# Altium schematic sheet 11-DisplayPort.SchDoc
size B; SheetNumber: 10; SheetTotal: 19
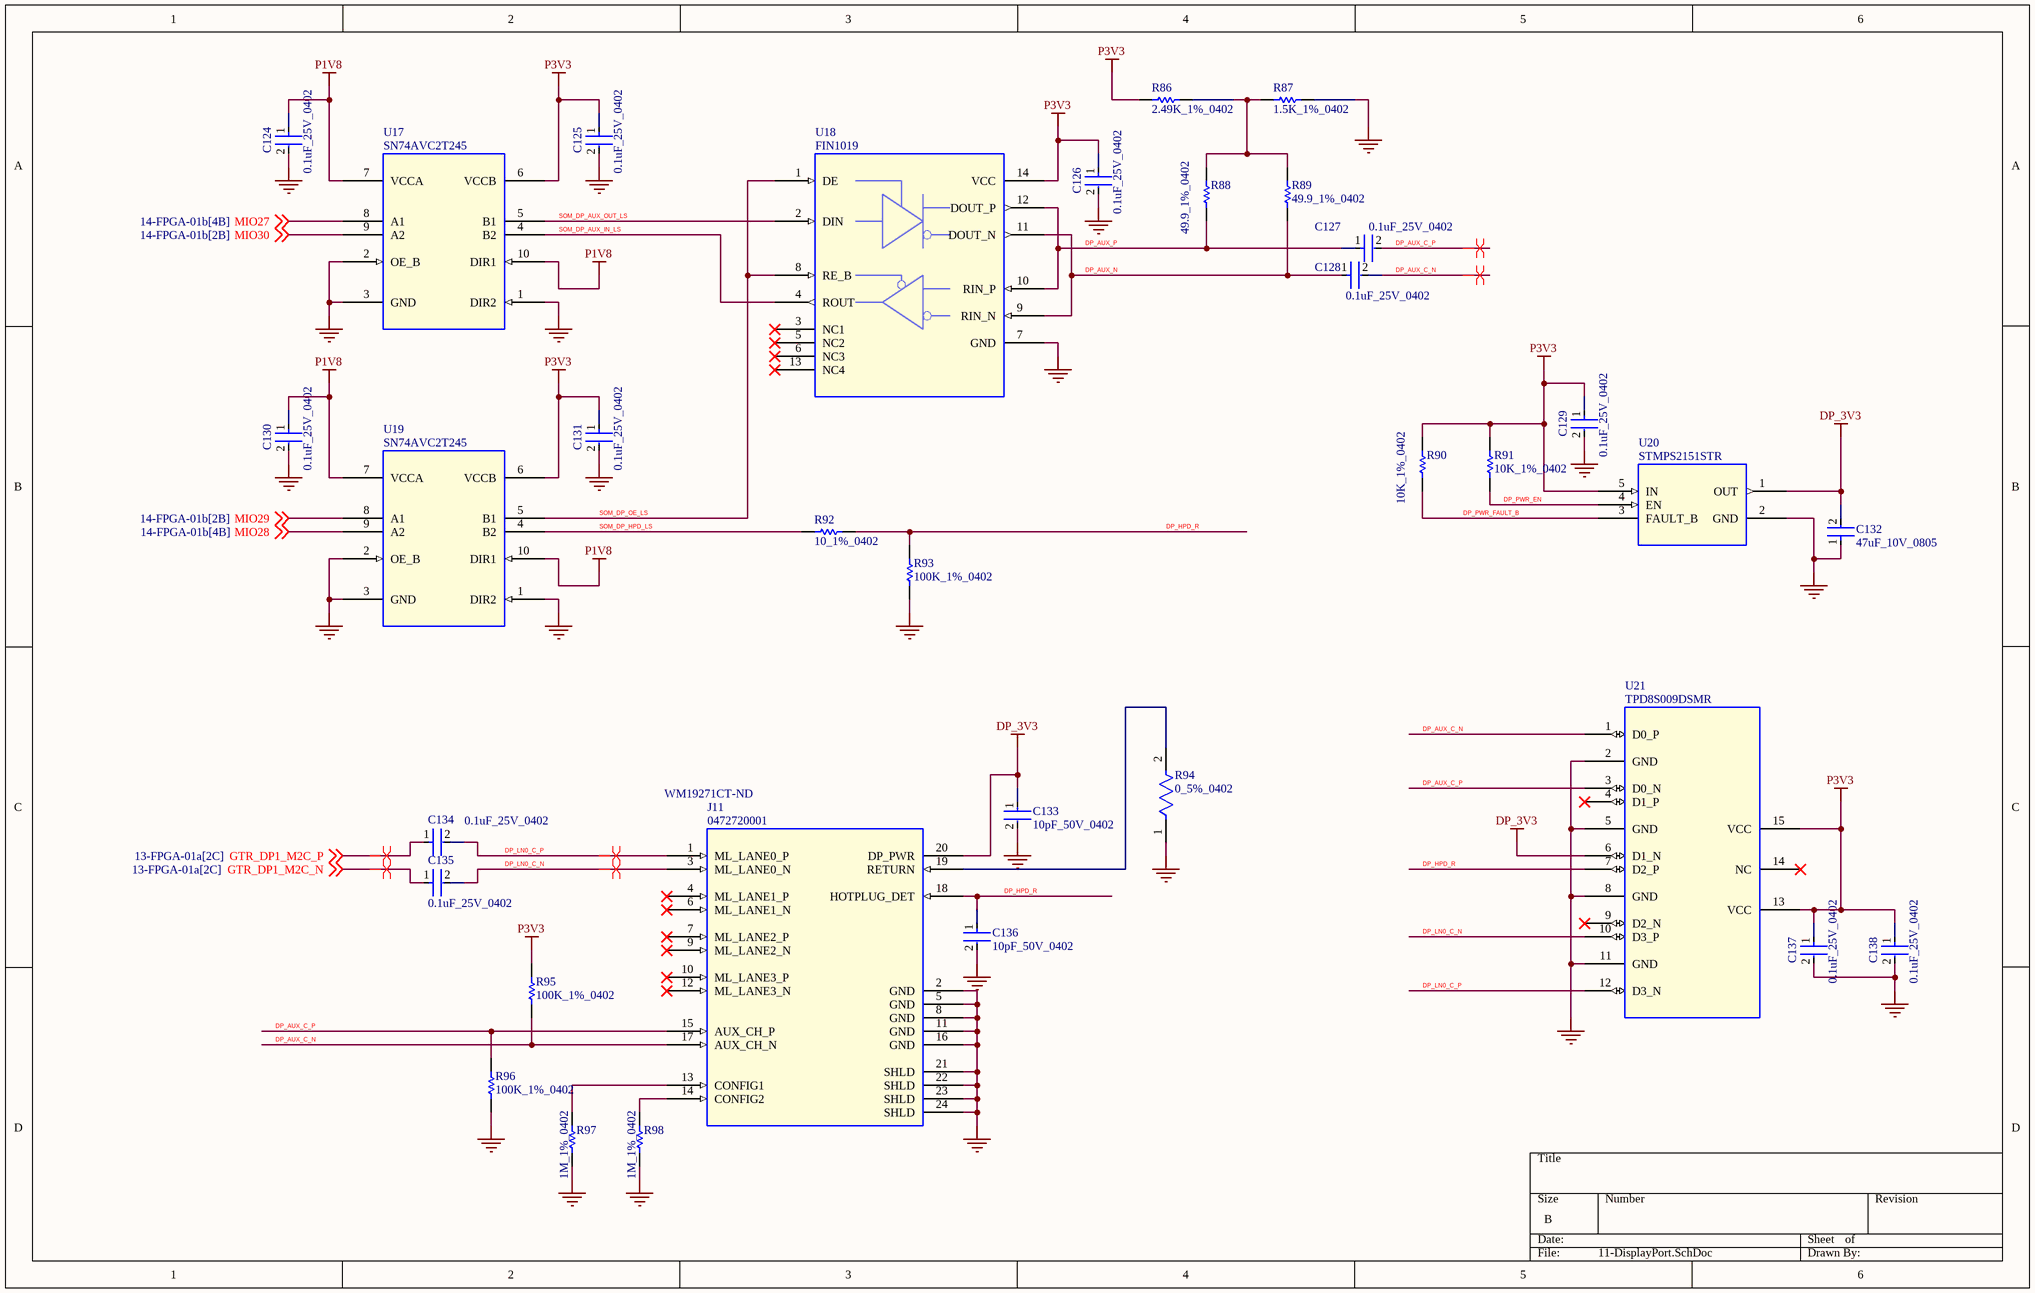
[diagram p0: 11-DisplayPort.SchDoc]

## Parts
C124  0.1uF_25V_0402  [FP-0402-L_1_0_1-W_0_5_0_1-IPC_C]
C125  0.1uF_25V_0402  [FP-0402-L_1_0_1-W_0_5_0_1-IPC_C]
C126  0.1uF_25V_0402  [FP-0402-L_1_0_1-W_0_5_0_1-IPC_C]
C127  0.1uF_25V_0402  [FP-0402-L_1_0_1-W_0_5_0_1-IPC_C]
C128  0.1uF_25V_0402  [FP-0402-L_1_0_1-W_0_5_0_1-IPC_C]
C129  0.1uF_25V_0402  [FP-0402-L_1_0_1-W_0_5_0_1-IPC_C]
C130  0.1uF_25V_0402  [FP-0402-L_1_0_1-W_0_5_0_1-IPC_C]
C131  0.1uF_25V_0402  [FP-0402-L_1_0_1-W_0_5_0_1-IPC_C]
C132  47uF_10V_0805  [FP-GRM21B-0_2-e0_2_0_7-IPC_A]
C133  10pF_50V_0402  [FP-C1005-050-0_05-IPC_C]
C134  0.1uF_25V_0402  [FP-0402-L_1_0_1-W_0_5_0_1-IPC_C]
C135  0.1uF_25V_0402  [FP-0402-L_1_0_1-W_0_5_0_1-IPC_C]
C136  10pF_50V_0402  [FP-C1005-050-0_05-IPC_C]
C137  0.1uF_25V_0402  [FP-0402-L_1_0_1-W_0_5_0_1-IPC_C]
C138  0.1uF_25V_0402  [FP-0402-L_1_0_1-W_0_5_0_1-IPC_C]
J11  0472720001  Supplier Part Number 1: WM19271CT-ND  [CON_MOLEX_47272]
R86  2.49K_1%_0402  [RESC1005X40X25ML05T05]
R87  1.5K_1%_0402  [RESC1005X40X25NL05T05]
R88  49.9_1%_0402  [RESC1005X40X25NL10T10]
R89  49.9_1%_0402  [RESC1005X40X25NL10T10]
R90  10K_1%_0402  [RESC1005X40X25ML05T05]
R91  10K_1%_0402  [RESC1005X40X25ML05T05]
R92  10_1%_0402  [RESC1005X40X25LL10T10]
R93  100K_1%_0402  [RESC1005X40X25ML05T05]
R94  0_5%_0402  [FP-AC0402-0_37-IPC_B]
R95  100K_1%_0402  [RESC1005X40X25ML05T05]
R96  100K_1%_0402  [RESC1005X40X25ML05T05]
R97  1M_1%_0402  [RESC1005X40X25NL10T10]
R98  1M_1%_0402  [RESC1005X40X25NL10T10]
U17  SN74AVC2T245  [QFN40P140X180X55-10]
U18  FIN1019  [TSSOP_14]
U19  SN74AVC2T245  [QFN40P140X180X55-10]
U20  STMPS2151STR  [SOT95P280X145_5]
U21  TPD8S009DSMR  [SON_15P]

## Nets
DP_3V3: C132.2 C133.1 J11.20(DP_PWR) U20.1(OUT) U21.6(D1_N)
GND: C124.2 C125.2 C126.2 C129.2 C130.2 C131.2 C132.1 C133.2 C136.2 C137.2 C138.2 J11.2(GND) J11.5(GND) J11.8(GND) J11.11(GND) J11.16(GND) J11.21(SHLD) J11.22(SHLD) J11.23(SHLD) J11.24(SHLD) R87.2 R93.2 R94.1 R96.1 R97.1 R98.1 U17.1(DIR2) U17.2(OE_B) U17.3(GND) U18.7(GND) U19.1(DIR2) U19.2(OE_B) U19.3(GND) U20.2(GND) U21.2(GND) U21.5(GND) U21.8(GND) U21.11(GND)
P1V8: C124.1 C130.1 U17.7(VCCA) U17.10(DIR1) U19.7(VCCA) U19.10(DIR1)
P3V3: C125.1 C126.1 C129.1 C131.1 C137.1 C138.1 R86.1 R90.2 R91.1 R95.2 U17.6(VCCB) U18.14(VCC) U19.6(VCCB) U20.5(IN) U21.13(VCC) U21.15(VCC)
DP_AUX_C_N: C128.2 J11.17(AUX_CH_N) R95.1 U21.1(D0_P)
DP_AUX_C_P: C127.2 J11.15(AUX_CH_P) R96.2 U21.3(D0_N)
DP_AUX_N: C128.1 R89.1 U18.9(RIN_N) U18.11(DOUT_N)
DP_AUX_P: C127.1 R88.1 U18.10(RIN_P) U18.12(DOUT_P)
DP_HPD_R: C136.1 J11.18(HOTPLUG_DET) R92.2 R93.1 U21.7(D2_P)
DP_LN0_C_N: C135.2 J11.3(ML_LANE0_N) U21.10(D3_P)
DP_LN0_C_P: C134.2 J11.1(ML_LANE0_P) U21.12(D3_N)
DP_PWR_EN: R91.2 U20.4(EN)
DP_PWR_FAULT_B: R90.1 U20.3(FAULT_B)
GTR_DP1_M2C_N: C135.1 ; off-sheet GTR_DP1_M2C_N
GTR_DP1_M2C_P: C134.1 ; off-sheet GTR_DP1_M2C_P
MIO27: U17.8(A1) ; off-sheet MIO27
MIO28: U19.9(A2) ; off-sheet MIO28
MIO29: U19.8(A1) ; off-sheet MIO29
MIO30: U17.9(A2) ; off-sheet MIO30
SOM_DP_AUX_IN_LS: U17.4(B2) U18.4(ROUT)
SOM_DP_AUX_OUT_LS: U17.5(B1) U18.2(DIN)
SOM_DP_HPD_LS: R92.1 U19.4(B2)
SOM_DP_OE_LS: U18.1(DE) U18.8(RE_B) U19.5(B1)
NetJ11_13: J11.13(CONFIG1) R97.2
NetJ11_14: J11.14(CONFIG2) R98.2
NetJ11_19: J11.19(RETURN) R94.2
NetR86_2: R86.2 R87.1 R88.2 R89.2

Not connected (* = marked no-connect by the designer): J11 4(ML_LANE1_P)* 6(ML_LANE1_N)* 7(ML_LANE2_P)* 9(ML_LANE2_N)* 10(ML_LANE3_P)* 12(ML_LANE3_N)*; U18 3(NC1)* 5(NC2)* 6(NC3)* 13(NC4)*; U21 4(D1_P)* 9(D2_N)* 14(NC)*

## Layout directives
differential pair: DP_AUX_C_N, DP_AUX_C_P, DP_LN0_C_N, DP_LN0_C_P, GTR_DP1_M2C_N, GTR_DP1_M2C_P

## Library data of the parts
C124-C131 C134 C135 C137 C138 = CMP-2008-02519-2: General Purpose Ceramic Capacitor, 0402, 100nF, 10%, X7R, 15%, 25V; Package Quantity: 1; Capacitance: 100nF; Min Operating Temperature: -55°C; Voltage: 25V; Voltage Rating: 25V; Construction: Flat; Max Operating Temperature: 125°C; Radiation Hardening: No; Depth: 0.5mm; Thickness: 0.022inch; Voltage Rating (DC): 25V; Number of Pins: 2; Lead Free: Lead Free; Series: -; REACH SVHC: No SVHC; Length: 1mm; Dielectric: X7R; RoHS Compliant: Yes; Mount: Surface Mount; Packaging: Tape and Reel; Case/Package: 0402; Case Code (Imperial): 0402; Termination: SMD/SMT; Width: 0.02inch; Case Code (Metric): 1005; Tolerance: 10%
C132 = CMP-2000-06341-2: Chip Multilayer Ceramic Capacitors for General Purpose, 0805, 47uF, X5R, 15%, 20%, 10V; Dissipation Factor: 0.035%; Length: 2mm; Voltage Rating: 10V; Mount: Surface Mount; Width: 0.049inch; Voltage Rating (DC): 10V; Lead Free: Lead Free; REACH SVHC: No SVHC; Termination: SMD/SMT; Case/Package: 0805; Dielectric: X5R; Capacitance: 47uF; Packaging: Tape and Reel; Max Operating Temperature: 85°C; Tolerance: 20%; Thickness: 0.057inch; Dielectric Material: Ceramic; Min Operating Temperature: -55°C; Height: 1.25mm; Case Code (Imperial): 0805; Case Code (Metric): 2012; Depth: 1.25mm; Voltage: 10V
C133 C136 = CMP-08246-002674-1: CAP CER 10PF 50V C0G 0402; Temperature Coefficient: 30ppm/°C; Dielectric Material: Ceramic; Termination: SMD/SMT; Width: 0.02inch; Case Code (Metric): 1005; Thickness: 0.022inch; Height: 0.5mm; REACH SVHC: No SVHC; Case Code (Imperial): 0402; Voltage: 50V; Capacitance: 10pF; Max Operating Temperature: 125°C; Length: 1mm; Construction: Flat; Packaging: Tape and Reel; Lead Free: Lead Free; Series: C; Depth: 0.5mm; Dielectric: C0G; Package Quantity: 1; Mount: Surface Mount; Voltage Rating (DC): 50V; Voltage Rating: 50V; Case/Package: 0402; RoHS Compliant: Yes; Min Operating Temperature: -55°C; Number of Pins: 2; Radiation Hardening: No; Weight: 2.3E-05oz
J11 = 0472720001: Conn Rcpt DisplayPort Female RA 20 Pos 0.5mm P Black SMT; Agile Part Number: CON-00139-01; Manufacturer: MOLEX; EDMVersionID: 488745758; Barcode: 400070; Part Type: RECEPTACLE; CIP Link: http://xsjbrdwin1/CIP-E/Component/Index/All?pn=400070; Manufacturer PN: 0472720001; PCB Footprint: CON_MOLEX_47272; Supplier 1: Digi-Key
R86 = CMP-2002-00377-1: Manufacturer: Vishay Dale; Part Number: CRCW04022K49FKTD
R87 = CMP-2002-08297-1: Part Number: CRCW04021K50FKED; Manufacturer: Vishay Dale
R88 R89 = CMP-2002-04448-1: Part Number: RK73H1ETTP49R9F; Manufacturer: KOA Speer
R90 R91 = CMP-2002-00433-1: Part Number: ERJ-2GEJ103X; Manufacturer: Panasonic
R92 = CMP-2002-04187-1: Part Number: RK73H1ETTP10R0F; Manufacturer: KOA Speer
R93 R95 R96 = CMP-1011-00736-2: Part Number: CRCW0402100KFKTD; Manufacturer: Vishay Dale
R94 = CMP-2002-01772-2: RESISTOR 0402 JUMPER ZERO OHM; Voltage Rating: 50V; Temperature Coefficient: 200ppm/°C; Tolerance: 1%; Power Rating: 62.5mW; Resistance: 0R; Min Operating Temperature: -55°C; Termination: SMD/SMT; Case/Package: 0402; Case Code (Imperial): 0402; Packaging: Tape and Reel; Case Code (Metric): 1005; Max Operating Temperature: 155°C; Series: AC
R97 R98 = CMP-2002-05706-1: Manufacturer: TE Connectivity / AMP; Part Number: CRG0402F1M0
U17 U19 = SN74AVC2T245: IC Lvl Trans 2-Bit Bidir 500Mbps 1.2-3.6V 50mA UQFN-10; Agile Part Number: ICS-00048-01; Manufacturer: TEXAS INSTRUMENTS; Manufacturer PN: SN74AVC2T245RSWR; EDMVersionID: 493023062; Barcode: 500012; Part Type: BUS TRANSCEIVER; CIP Link: http://xsjbrdwin1/CIP-E/Component/Index/All?pn=500012; PCB Footprint: QFN40P140X180X55-10
U18 = FIN1019: IC Lvl Trans LVTTL-LVDS Diff 400Mbps 3.3V 2.5nSec TSSOP-14; Agile Part Number: ICS-00279-01; Manufacturer: FAIRCHILD; Manufacturer PN: FIN1019MTCX; EDMVersionID: 489931726; Barcode: 500414; Part Type: LVDS DRIVER/RECEIVER; CIP Link: http://xsjbrdwin1/CIP-E/Component/Index/All?pn=500414; PCB Footprint: TSSOP_14
U20 = STMPS2151: IC Switch Power 500mA 2.7-5.5V 110mR SOT23-5; Agile Part Number: ICS-00662-01; Manufacturer: STMicroelectronics; Supply Voltage: Not Required; Barcode: 50000178; CIP Link: http://xsjbrdwin1/CIP-E/Component/Index/All?pn=50000178; Part Type: LOAD SWITCH; Manufacturer PN: STMPS2151STR; Datasheet: http://www.st.com/content/ccc/resource/technical/document/datasheet/e8/d7/48/25/eb/87/45/b3/CD00167470.pdf/files/CD00167470.pdf/jcr:content/translations/en.CD00167470.pdf; PCB Footprint: SOT95P280X145_5
U21 = TPD8S009DSMR: TVSD 8-Ch 5.5V 2.5A 25W 4GHz SON-15 8KV Contact Discharge; Agile Part Number: ICS-00196-01; Manufacturer: TEXAS INSTRUMENTS; EDMVersionID: 493517914; Barcode: 500262; PCB Footprint: SON_15P; CIP Link: http://xsjbrdwin1/CIP-E/Component/Index/All?pn=500262; Part Type: ESD PROTECTOR; Manufacturer PN: TPD8S009DSMR